# Altium schematic sheet Push Button.schdoc
size 127 x 99 mm
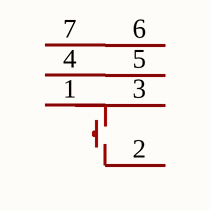
[diagram p0: Push Button.schdoc]

## Parts
SW?  TSA020B3418A02  [SW-SMD_BZCN_YTSA020XXXX]  (value not drawn)

## Nets

Not connected (* = marked no-connect by the designer): SW? 1 2 3 4 5 6 7

## Library data of the parts
SW? = TSA020B3418A02: Manufacturer: BZCN(博众电气); Add into BOM: yes; Actuator Style: Round Button; Operating Force: 180gf; Switch Length: 4.5mm; Switch Width: 3.4mm; Contact Current: 50mA; Voltage Rating (DC): 12V; Symbol: TSA020B3418A02; Device: TSA020B3418A02; LCSC Part Name: 4.5*3.4*3.4mm 卧贴 轻触开关; Supplier Part: C2888897; Manufacturer Part: TSA020B3418A02; Supplier Footprint: SMD; JLCPCB Part Class: Extended Part; Datasheet: https://atta.szlcsc.com/upload/public/pdf/source/20210826/A0412DE55436A0A9154118D90A036ADB.pdf; Supplier: LCSC; Convert to PCB: yes; Mounting Style: Surface Mount; Switch Height: 3.4mm; Voltage Rating (AC): -; Mechanical Life: -